# Altium schematic sheet Mini-F1C200s.SchDoc
size C; SheetNumber: 1; SheetTotal: 1; SPICEModelCacheDYMZMBPH: <root> / <DocumentId>DYMZMBPH</DocumentId> / <CacheFrame Number="0"> / <Model Name="cap" Kind="MDL"> / <Text>*Default semiconductor capacitor / .MODEL CAP C()</Text> / </Model> / <Model Name="xtal" Kind="CKT"> / <Text>*Generic type:crystal pkg:HC33/51 / .SUBCKT XTAL 1 2 PARAMS: FREQ=1Meg RS=750 C=13pf Q=1000 / LX 1 3 {((Q*RS)/(6.2831852*FREQ))} IC=0.5M / CX 3 4 {(1/(Q*6.2831852*FREQ*RS))} / C0 1 2 {C} / RS 4 2 {RS} / .ENDS XTAL</Text> / </Model> / <Model Name="led0" Kind="MDL"> / <Text>*Typ INFRARED GaAs LED: Vf=1.2V Vr=5V If=40mA trr=3uS / *LED Pinout: 1=A, 2=K / .MODEL LED0 D (IS=93.5P RS=84M N=2.63 BV=5 IBV=10U / + CJO=2.97P VJ=.75 M=.333 TT=4.32U)</Text> / </Model> / </CacheFrame> / </root>
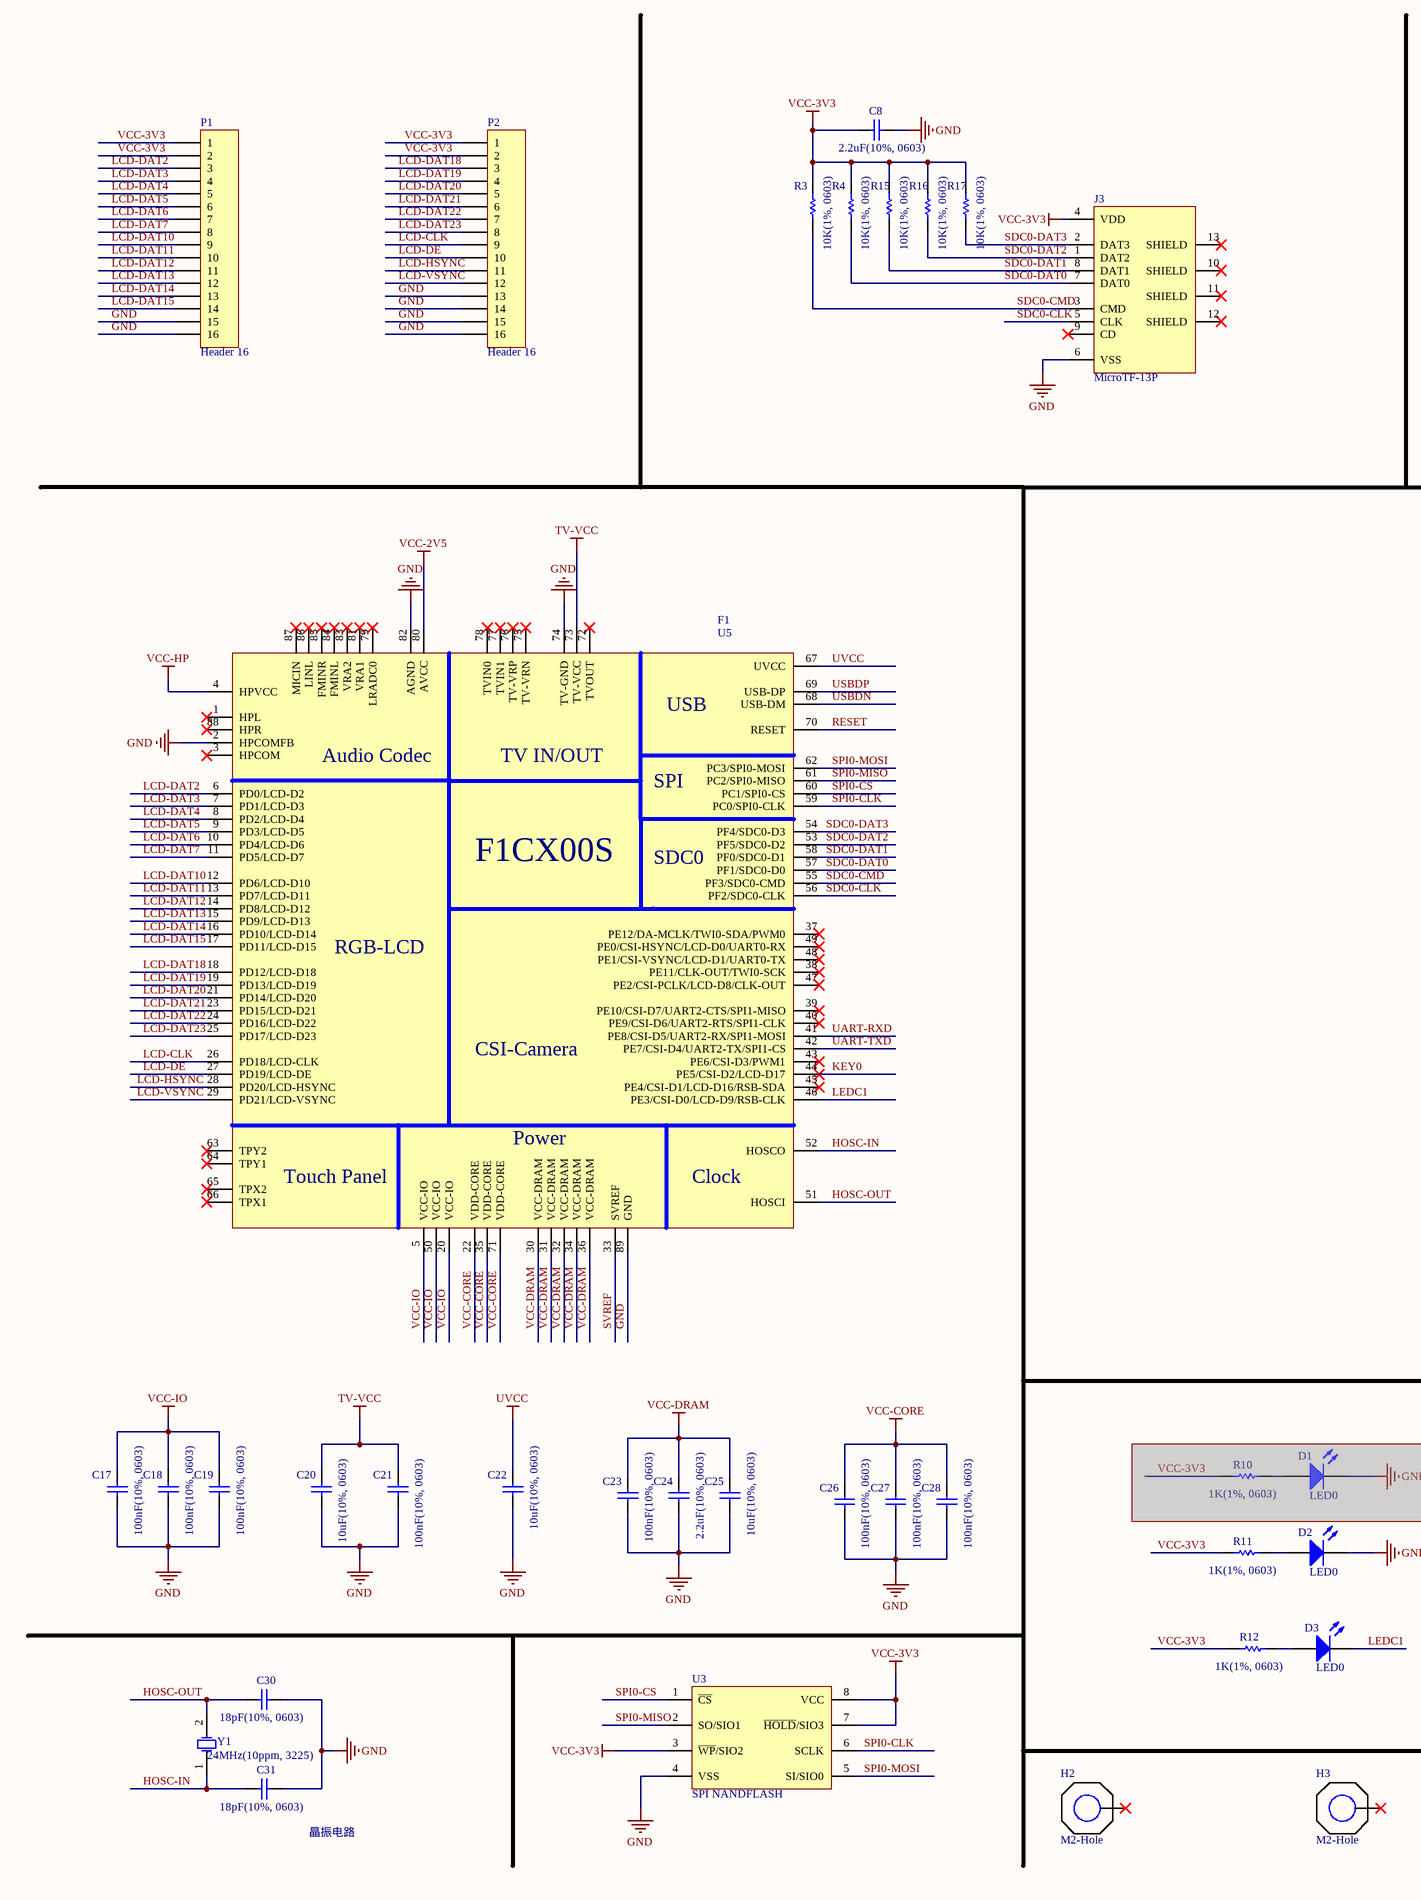
[diagram p0: Mini-F1C200s.SchDoc, left]
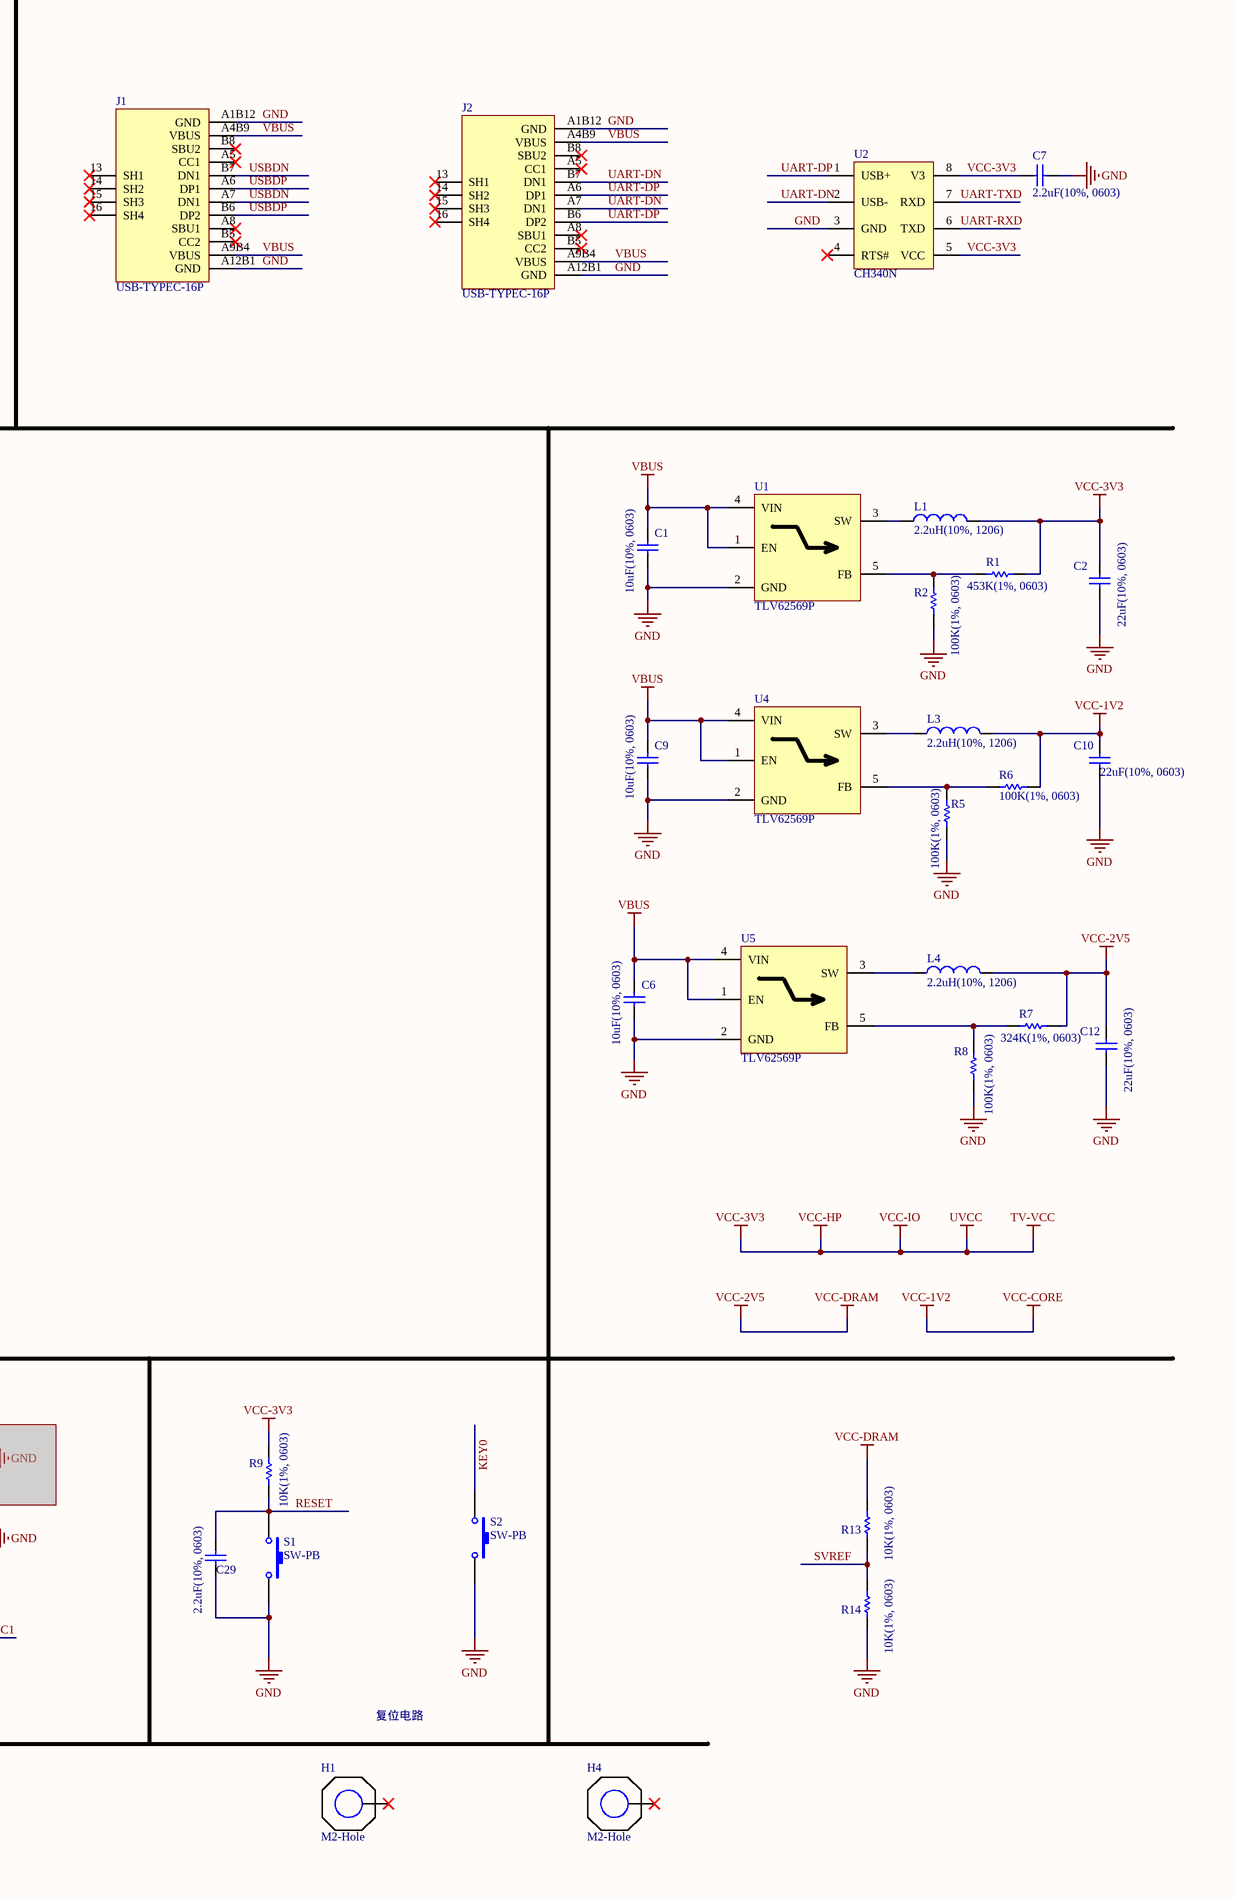
[diagram p1: Mini-F1C200s.SchDoc, right]

## Parts
C1  10uF(10%, 0603)  [0603C]
C2  22uF(10%, 0603)  [0603C]
C6  10uF(10%, 0603)  [0603C]
C7  2.2uF(10%, 0603)  [0603C]
C8  2.2uF(10%, 0603)  [0603C]
C9  10uF(10%, 0603)  [0603C]
C10  22uF(10%, 0603)  [0603C]
C12  22uF(10%, 0603)  [0603C]
C17  100nF(10%, 0603)  [0603C]
C18  100nF(10%, 0603)  [0603C]
C19  100nF(10%, 0603)  [0603C]
C20  10uF(10%, 0603)  [0603C]
C21  100nF(10%, 0603)  [0603C]
C22  10uF(10%, 0603)  [0603C]
C23  100nF(10%, 0603)  [0603C]
C24  2.2uF(10%, 0603)  [0603C]
C25  10uF(10%, 0603)  [0603C]
C26  100nF(10%, 0603)  [0603C]
C27  100nF(10%, 0603)  [0603C]
C28  100nF(10%, 0603)  [0603C]
C29  2.2uF(10%, 0603)  [0603C]
C30  18pF(10%, 0603)  [0603C]
C31  18pF(10%, 0603)  [0603C]
D1  LED0  [LED-0805]  (masked out: inside a compile mask, not in the netlist)
D2  LED0  [LED-0805]
D3  LED0  [LED-0805]
F1  U5  [F1C200S-FP]
H1  M2-Hole  [M2-Hole]
H2  M2-Hole  [M2-Hole]
H3  M2-Hole  [M2-Hole]
H4  M2-Hole  [M2-Hole]
J1  USB-TYPEC-16P  [USB-TYPEC-16P]
J2  USB-TYPEC-16P  [USB-TYPEC-16P]
J3  MicroTF-13P  [MicroTF-13P-WOCD]
L1  2.2uH(10%, 1206)  [INDC-2520]
L3  2.2uH(10%, 1206)  [INDC-2520]
L4  2.2uH(10%, 1206)  [INDC-2520]
P1  Header 16  [HDR1X16]
P2  Header 16  [HDR1X16]
R1  453K(1%, 0603)  [0603R]
R2  100K(1%, 0603)  [0603R]
R3  10K(1%, 0603)  [0603R]
R4  10K(1%, 0603)  [0603R]
R5  100K(1%, 0603)  [0603R]
R6  100K(1%, 0603)  [0603R]
R7  324K(1%, 0603)  [0603R]
R8  100K(1%, 0603)  [0603R]
R9  10K(1%, 0603)  [0603R]
R10  1K(1%, 0603)  [0603R]  (masked out: inside a compile mask, not in the netlist)
R11  1K(1%, 0603)  [0603R]
R12  1K(1%, 0603)  [0603R]
R13  10K(1%, 0603)  [0603R]
R14  10K(1%, 0603)  [0603R]
R15  10K(1%, 0603)  [0603R]
R16  10K(1%, 0603)  [0603R]
R17  10K(1%, 0603)  [0603R]
S1  SW-PB  [SW2-4R2X3R4]
S2  SW-PB  [SW2-4R2X3R4]
U1  TLV62569P  [SOT23-5]
U2  CH340N  [SOP8]
U3  SPI NANDFLASH  [SWON127P8]
U4  TLV62569P  [SOT23-5]
U5  TLV62569P  [SOT23-5]
Y1  24MHz(10ppm, 3225)  [SMD5032-2P]

## Nets
GND: C1.1 C2.2 C6.2 C7.2 C8.2 C9.2 C10.2 C12.1 C17.1 C18.1 C19.1 C20.1 C21.1 C22.1 C23.1 C24.1 C25.1 C26.1 C27.1 C28.1 C29.2 C30.2 C31.2 D2.2(K) F1.2(HPCOMFB) F1.74(TV-GND) F1.82(AGND) F1.89(GND) J1.A1B12(GND) J1.A12B1(GND) J2.A1B12(GND) J2.A12B1(GND) J3.6(VSS) P1.15 P1.16 P2.13 P2.14 P2.15 P2.16 R2.1 R5.2 R8.1 R14.1 S1.2 S2.2 U1.2(GND) U2.3(GND) U3.4(VSS) U4.2(GND) U5.2(GND)
UVCC: C2.1 C7.1 C8.1 C17.2 C18.2 C19.2 C20.2 C21.2 C22.2 F1.4(HPVCC) F1.5(VCC-IO) F1.20(VCC-IO) F1.50(VCC-IO) F1.67(UVCC) F1.73(TV-VCC) J3.4(VDD) L1.2 P1.1 P1.2 P2.1 P2.2 R1.2 R3.2 R4.2 R9.2 R11.1 R12.1 R15.2 R16.2 R17.2 U2.5(VCC) U2.8(V3) U3.3(~{WP}/SIO2) U3.7(~{HOLD}/SIO3) U3.8(VCC)  [also labelled TV-VCC, VCC-3V3, VCC-HP, VCC-IO]
VBUS: C1.2 C6.1 C9.1 J1.A4B9(VBUS) J1.A9B4(VBUS) J2.A4B9(VBUS) J2.A9B4(VBUS) U1.1(EN) U1.4(VIN) U4.1(EN) U4.4(VIN) U5.1(EN) U5.4(VIN)
VCC-CORE: C10.1 C26.2 C27.2 C28.2 F1.22(VDD-CORE) F1.35(VDD-CORE) F1.71(VDD-CORE) L3.2 R6.2  [also labelled VCC-1V2]
VCC-DRAM: C12.2 C23.2 C24.2 C25.2 F1.30(VCC-DRAM) F1.31(VCC-DRAM) F1.32(VCC-DRAM) F1.34(VCC-DRAM) F1.36(VCC-DRAM) F1.80(AVCC) L4.2 R7.1 R13.2  [also labelled VCC-2V5]
HOSC-IN: C31.1 F1.52(HOSCO) Y1.1(OSC1)
HOSC-OUT: C30.1 F1.51(HOSCI) Y1.2(OSC2)
KEY0: F1.44(PE5/CSI-D2/LCD-D17) S2.1
LCD-CLK: F1.26(PD18/LCD-CLK) P2.9
LCD-DAT2: F1.6(PD0/LCD-D2) P1.3
LCD-DAT3: F1.7(PD1/LCD-D3) P1.4
LCD-DAT4: F1.8(PD2/LCD-D4) P1.5
LCD-DAT5: F1.9(PD3/LCD-D5) P1.6
LCD-DAT6: F1.10(PD4/LCD-D6) P1.7
LCD-DAT7: F1.11(PD5/LCD-D7) P1.8
LCD-DAT10: F1.12(PD6/LCD-D10) P1.9
LCD-DAT11: F1.13(PD7/LCD-D11) P1.10
LCD-DAT12: F1.14(PD8/LCD-D12) P1.11
LCD-DAT13: F1.15(PD9/LCD-D13) P1.12
LCD-DAT14: F1.16(PD10/LCD-D14) P1.13
LCD-DAT15: F1.17(PD11/LCD-D15) P1.14
LCD-DAT18: F1.18(PD12/LCD-D18) P2.3
LCD-DAT19: F1.19(PD13/LCD-D19) P2.4
LCD-DAT20: F1.21(PD14/LCD-D20) P2.5
LCD-DAT21: F1.23(PD15/LCD-D21) P2.6
LCD-DAT22: F1.24(PD16/LCD-D22) P2.7
LCD-DAT23: F1.25(PD17/LCD-D23) P2.8
LCD-DE: F1.27(PD19/LCD-DE) P2.10
LCD-HSYNC: F1.28(PD20/LCD-HSYNC) P2.11
LCD-VSYNC: F1.29(PD21/LCD-VSYNC) P2.12
LEDC1: D3.2(K) F1.46(PE3/CSI-D0/LCD-D9/RSB-CLK)
RESET: C29.1 F1.70(RESET) R9.1 S1.1
SDC0-CLK: F1.56(PF2/SDC0-CLK) J3.5(CLK)
SDC0-CMD: F1.55(PF3/SDC0-CMD) J3.3(CMD) R3.1
SDC0-DAT0: F1.57(PF1/SDC0-D0) J3.7(DAT0) R4.1
SDC0-DAT1: F1.58(PF0/SDC0-D1) J3.8(DAT1) R15.1
SDC0-DAT2: F1.53(PF5/SDC0-D2) J3.1(DAT2) R16.1
SDC0-DAT3: F1.54(PF4/SDC0-D3) J3.2(DAT3) R17.1
SPI0-CLK: F1.59(PC0/SPI0-CLK) U3.6(SCLK)
SPI0-CS: F1.60(PC1/SPI0-CS) U3.1(~{CS})
SPI0-MISO: F1.61(PC2/SPI0-MISO) U3.2(SO/SIO1)
SPI0-MOSI: F1.62(PC3/SPI0-MOSI) U3.5(SI/SIO0)
SVREF: F1.33(SVREF) R13.1 R14.2
UART-DN: J2.A7(DN1) J2.B7(DN1) U2.2(USB-)
UART-DP: J2.A6(DP1) J2.B6(DP2) U2.1(USB+)
UART-RXD: F1.41(PE8/CSI-D5/UART2-RX/SPI1-MOSI) U2.6(TXD)
UART-TXD: F1.42(PE7/CSI-D4/UART2-TX/SPI1-CS) U2.7(RXD)
USBDN: F1.68(USB-DM) J1.A7(DN1) J1.B7(DN1)
USBDP: F1.69(USB-DP) J1.A6(DP1) J1.B6(DP2)
NetD2_1: D2.1(A) R11.2
NetD3_1: D3.1(A) R12.2
NetL1_1: L1.1 U1.3(SW)
NetL3_1: L3.1 U4.3(SW)
NetL4_1: L4.1 U5.3(SW)
NetR1_1: R1.1 R2.2 U1.5(FB)
NetR5_1: R5.1 R6.1 U4.5(FB)
NetR7_2: R7.2 R8.2 U5.5(FB)

Not connected (* = marked no-connect by the designer): F1 1(HPL)* 3(HPCOM)* 37(PE12/DA-MCLK/TWI0-SDA/PWM0)* 38(PE11/CLK-OUT/TWI0-SCK)* 39(PE10/CSI-D7/UART2-CTS/SPI1-MISO)* 40(PE9/CSI-D6/UART2-RTS/SPI1-CLK)* 43(PE6/CSI-D3/PWM1)* 45(PE4/CSI-D1/LCD-D16/RSB-SDA)* 47(PE2/CSI-PCLK/LCD-D8/CLK-OUT)* 48(PE1/CSI-VSYNC/LCD-D1/UART0-TX)* 49(PE0/CSI-HSYNC/LCD-D0/UART0-RX)* 63(TPY2)* 64(TPY1)* 65(TPX2)* 66(TPX1)* 72(TVOUT)* 75(TV-VRN)* 76(TV-VRP)* 77(TVIN1)* 78(TVIN0)* 79(LRADC0)* 81(VRA1)* 83(VRA2)* 84(FMINL)* 85(FMINR)* 86(LINL)* 87(MICIN)* 88(HPR)*; H1 0(5)*; H2 0(5)*; H3 0(5)*; H4 0(5)*; J1 13(SH1)* 14(SH2)* 15(SH3)* 16(SH4)* A5(CC1)* A8(SBU1)* B5(CC2)* B8(SBU2)*; J2 13(SH1)* 14(SH2)* 15(SH3)* 16(SH4)* A5(CC1)* A8(SBU1)* B5(CC2)* B8(SBU2)*; J3 9(CD)* 10(SHIELD)* 11(SHIELD)* 12(SHIELD)* 13(SHIELD)*; U2 4(RTS#)*

## Notes on the sheet
- 复位电路
- 晶振电路
- (in symbol F1Cx00s) USB; Audio Codec; TV IN/OUT; SPI; F1CX00S; SDC0; RGB-LCD; CSI-Camera; Power; Touch Panel; Clock

## Library data of the parts
C1 C2 C6-C10 C12 C17-C31 = Cap: Capacitor; Value: 100pF; Published: 8-Jun-2000; LatestRevisionDate: 17-Jul-2002; LatestRevisionNote: Re-released for DXP Platform.; PackageReference: RAD-0.3; Publisher: Altium Limited; PackageDescription: Radial Cap, Thru-Hole; 2 Leads; 0.3 in Pin Spacing
D1-D3 = LED0: Typical INFRARED GaAs LED; Published: 8-Jun-2000; LatestRevisionDate: 08-Jul-2005; LatestRevisionNote: Mech Layer 1 removed.; PackageReference: LED-0; Publisher: Altium Limited; PackageDescription: LED; 2 Leads
F1 = F1Cx00s
J3 = MicroTF-13P: XunPu Micro-SD card slot,  lable: TF-115
L1 L3 L4 = Inductor: Code_IEC: 1005; Value: 10mH; Published: 8-Jun-2000; LatestRevisionDate: 29-May-2009; LatestRevisionNote: IPC-7351 Footprint Added.; PackageReference: 0402-A; Publisher: Altium Limited; PackageDescription: Chip Inductor; Code_JEITA: 0402
P1 P2 = Header 16: Header, 16-Pin; LatestRevisionDate: 17-Jul-2002; LatestRevisionNote: Re-released for DXP Platform.; Publisher: Altium Limited
R1-R9 R13-R17 = Res1: Resistor; Value: 1K; Published: 8-Jun-2000; LatestRevisionDate: 17-Jul-2002; LatestRevisionNote: Re-released for DXP Platform.; PackageReference: AXIAL-0.3; Publisher: Altium Limited; PackageDescription: Axial Device, Thru-Hole; 2 Leads; 0.3 in Pin Spacing
R10-R12 = Res1: Resistor; Published: 8-Jun-2000; LatestRevisionDate: 17-Jul-2002; LatestRevisionNote: Re-released for DXP Platform.; PackageReference: AXIAL-0.3; Publisher: Altium Limited; PackageDescription: Axial Device, Thru-Hole; 2 Leads; 0.3 in Pin Spacing; Value: 1K
S1 S2 = SW-PB: Switch; Published: 24-Mar-1999; LatestRevisionDate: 17-Jul-2002; LatestRevisionNote: Re-released for DXP Platform.; PackageReference: SPST-2; Publisher: Altium Limited; PackageDescription: Switch; 2 Leads
U1 U4 U5 = TLV62569P: The TLV62569 is a high-efficiency synchronous step-down converter. The device operates with an adaptive off time with peak current control scheme
U2 = CH340N: UART To USB
U3 = XT26G10C
Y1 = XTAL: Crystal Oscillator; Published: 8-Jun-2000; LatestRevisionDate: 17-Jul-2002; LatestRevisionNote: Re-released for DXP Platform.; PackageReference: R38; Publisher: Altium Limited; PackageDescription: Crystal, Thru-Hole; 2 Leads; Body 3.1 x 8.2 mm (Dia.xH)